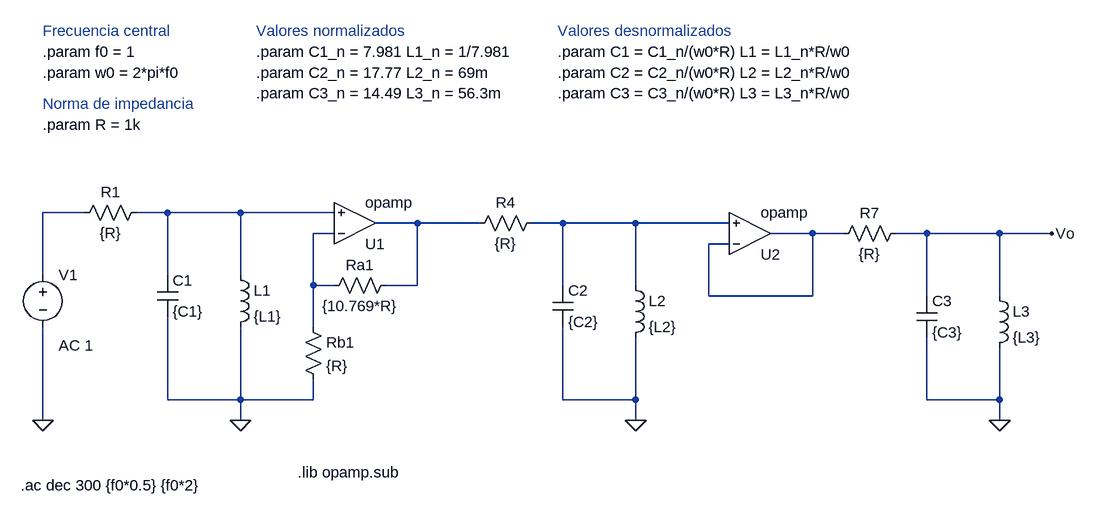
[diagram p0: schematic TS2_Pasiva.asc]
TS2_Pasiva.asc, the LTspice schematic file:
Version 4
SHEET 1 1600 680
WIRE 64 64 0 64
WIRE 192 64 144 64
WIRE 304 64 192 64
WIRE 448 64 304 64
WIRE 576 80 512 80
WIRE 672 80 576 80
WIRE 800 80 752 80
WIRE 912 80 800 80
WIRE 1056 80 912 80
WIRE 448 96 416 96
WIRE 1184 96 1120 96
WIRE 1232 96 1184 96
WIRE 1360 96 1312 96
WIRE 1472 96 1360 96
WIRE 1552 96 1472 96
WIRE 1056 112 1024 112
WIRE 0 160 0 64
WIRE 192 160 192 64
WIRE 304 160 304 64
WIRE 416 176 416 96
WIRE 448 176 416 176
WIRE 576 176 576 80
WIRE 576 176 528 176
WIRE 800 176 800 80
WIRE 912 176 912 80
WIRE 1024 192 1024 112
WIRE 1184 192 1184 96
WIRE 1184 192 1024 192
WIRE 1360 192 1360 96
WIRE 1472 192 1472 96
WIRE 416 240 416 176
WIRE 192 352 192 224
WIRE 304 352 304 240
WIRE 304 352 192 352
WIRE 416 352 416 320
WIRE 416 352 304 352
WIRE 800 352 800 240
WIRE 912 352 912 256
WIRE 912 352 800 352
WIRE 1360 352 1360 256
WIRE 1472 352 1472 272
WIRE 1472 352 1360 352
WIRE 0 384 0 240
WIRE 304 384 304 352
WIRE 912 384 912 352
WIRE 1472 384 1472 352
FLAG 304 384 0
FLAG 912 384 0
FLAG 1472 384 0
FLAG 1552 96 Vo
FLAG 0 384 0
SYMBOL res 160 48 R90
WINDOW 0 0 56 VBottom 2
WINDOW 3 32 56 VTop 2
SYMATTR InstName R1
SYMATTR Value {R}
SYMBOL cap 176 160 R0
SYMATTR InstName C1
SYMATTR Value {C1}
SYMBOL ind 288 144 R0
SYMATTR InstName L1
SYMATTR Value {L1}
SYMBOL res 400 224 R0
SYMATTR InstName Rb1
SYMATTR Value {R}
SYMBOL res 544 160 R90
WINDOW 0 0 56 VBottom 2
WINDOW 3 32 56 VTop 2
SYMATTR InstName Ra1
SYMATTR Value {10.769*R}
SYMBOL OpAmps\\opamp 480 144 M180
SYMATTR InstName U1
SYMBOL res 768 64 R90
WINDOW 0 0 56 VBottom 2
WINDOW 3 32 56 VTop 2
SYMATTR InstName R4
SYMATTR Value {R}
SYMBOL cap 784 176 R0
SYMATTR InstName C2
SYMATTR Value {C2}
SYMBOL ind 896 160 R0
SYMATTR InstName L2
SYMATTR Value {L2}
SYMBOL OpAmps\\opamp 1088 160 M180
SYMATTR InstName U2
SYMBOL res 1328 80 R90
WINDOW 0 0 56 VBottom 2
WINDOW 3 32 56 VTop 2
SYMATTR InstName R7
SYMATTR Value {R}
SYMBOL cap 1344 192 R0
SYMATTR InstName C3
SYMATTR Value {C3}
SYMBOL ind 1456 176 R0
SYMATTR InstName L3
SYMATTR Value {L3}
SYMBOL voltage 0 144 R0
WINDOW 123 24 124 Left 2
WINDOW 39 0 0 Left 0
SYMATTR InstName V1
SYMATTR Value ""
SYMATTR Value2 AC 1
TEXT 392 464 Left 2 !.lib opamp.sub
TEXT 0 -216 Left 2 ;Frecuencia central
TEXT 0 -184 Left 2 !.param f0 = 1
TEXT 0 -72 Left 2 !.param R = 1k
TEXT 0 -104 Left 2 ;Norma de impedancia
TEXT 0 -152 Left 2 !.param w0 = 2*pi*f0
TEXT 328 -216 Left 2 ;Valores normalizados
TEXT 328 -184 Left 2 !.param C1_n = 7.981 L1_n = 1/7.981
TEXT 328 -152 Left 2 !.param C2_n = 17.77 L2_n = 69m
TEXT 328 -120 Left 2 !.param C3_n = 14.49 L3_n = 56.3m
TEXT 792 -216 Left 2 ;Valores desnormalizados
TEXT 792 -184 Left 2 !.param C1 = C1_n/(w0*R) L1 = L1_n*R/w0
TEXT 792 -152 Left 2 !.param C2 = C2_n/(w0*R) L2 = L2_n*R/w0
TEXT 792 -120 Left 2 !.param C3 = C3_n/(w0*R) L3 = L3_n*R/w0
TEXT -34 484 Left 2 !.ac dec 300 {f0*0.5} {f0*2}

The netlist it stands for:
* TS2_Pasiva.asc
R1 N002 N001 {R}
C1 N002 0 {C1}
L1 N002 0 {L1}
Rb1 N005 0 {R}
Ra1 N003 N005 {10.769*R}
XU1 N005 N002 N003 opamp Aol=100K GBW=10Meg  ; pins invin noninvin out
R4 N004 N003 {R}
C2 N004 0 {C2}
L2 N004 0 {L2}
XU2 N006 N004 N006 opamp Aol=100K GBW=10Meg  ; pins invin noninvin out
R7 Vo N006 {R}
C3 Vo 0 {C3}
L3 Vo 0 {L3}
V1 N001 0 AC 1
.lib opamp.sub
* Frecuencia central
.param f0 = 1
.param R = 1k
* Norma de impedancia
.param w0 = 2*pi*f0
* Valores normalizados
.param C1_n = 7.981 L1_n = 1/7.981
.param C2_n = 17.77 L2_n = 69m
.param C3_n = 14.49 L3_n = 56.3m
* Valores desnormalizados
.param C1 = C1_n/(w0*R) L1 = L1_n*R/w0
.param C2 = C2_n/(w0*R) L2 = L2_n*R/w0
.param C3 = C3_n/(w0*R) L3 = L3_n*R/w0
.ac dec 300 {f0*0.5} {f0*2}
.backanno
.end